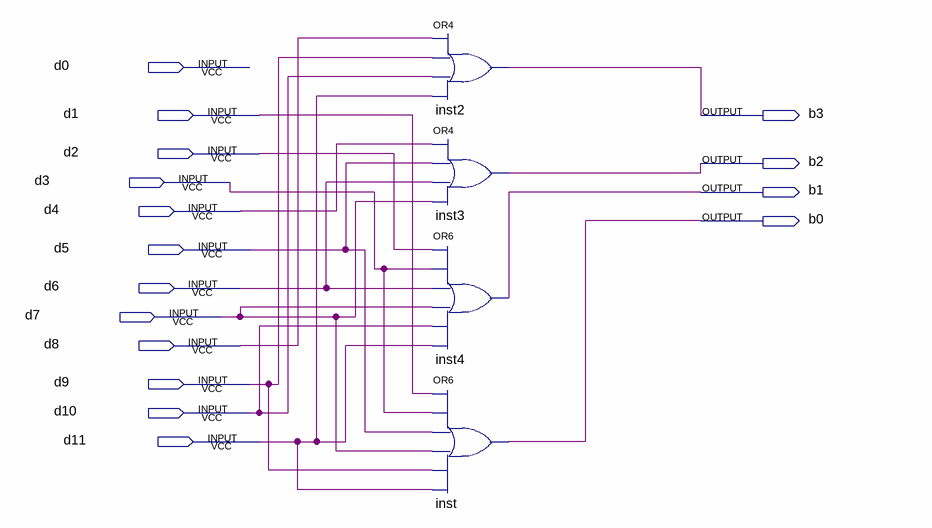
[diagram p0: schematic sheet]
// Quartus schematic DtoB.bdf as structural Verilog: 4 symbols, 16 pins
module DtoB (
  input  d0,
  input  d1,
  input  d2,
  input  d3,
  input  d4,
  input  d5,
  input  d6,
  input  d7,
  input  d8,
  input  d9,
  input  d10,
  input  d11,
  output b3,
  output b2,
  output b1,
  output b0
);

  or inst2 (b3, d8, d9, d10, d11);
  or inst3 (b2, d4, d5, d6, d7);
  or inst4 (b1, d2, d3, d6, d7, d10, d11);
  or inst (b0, d1, d3, d5, d7, d9, d11);
endmodule
